# EAGLE design power_board (EAGLE 9.6.2)
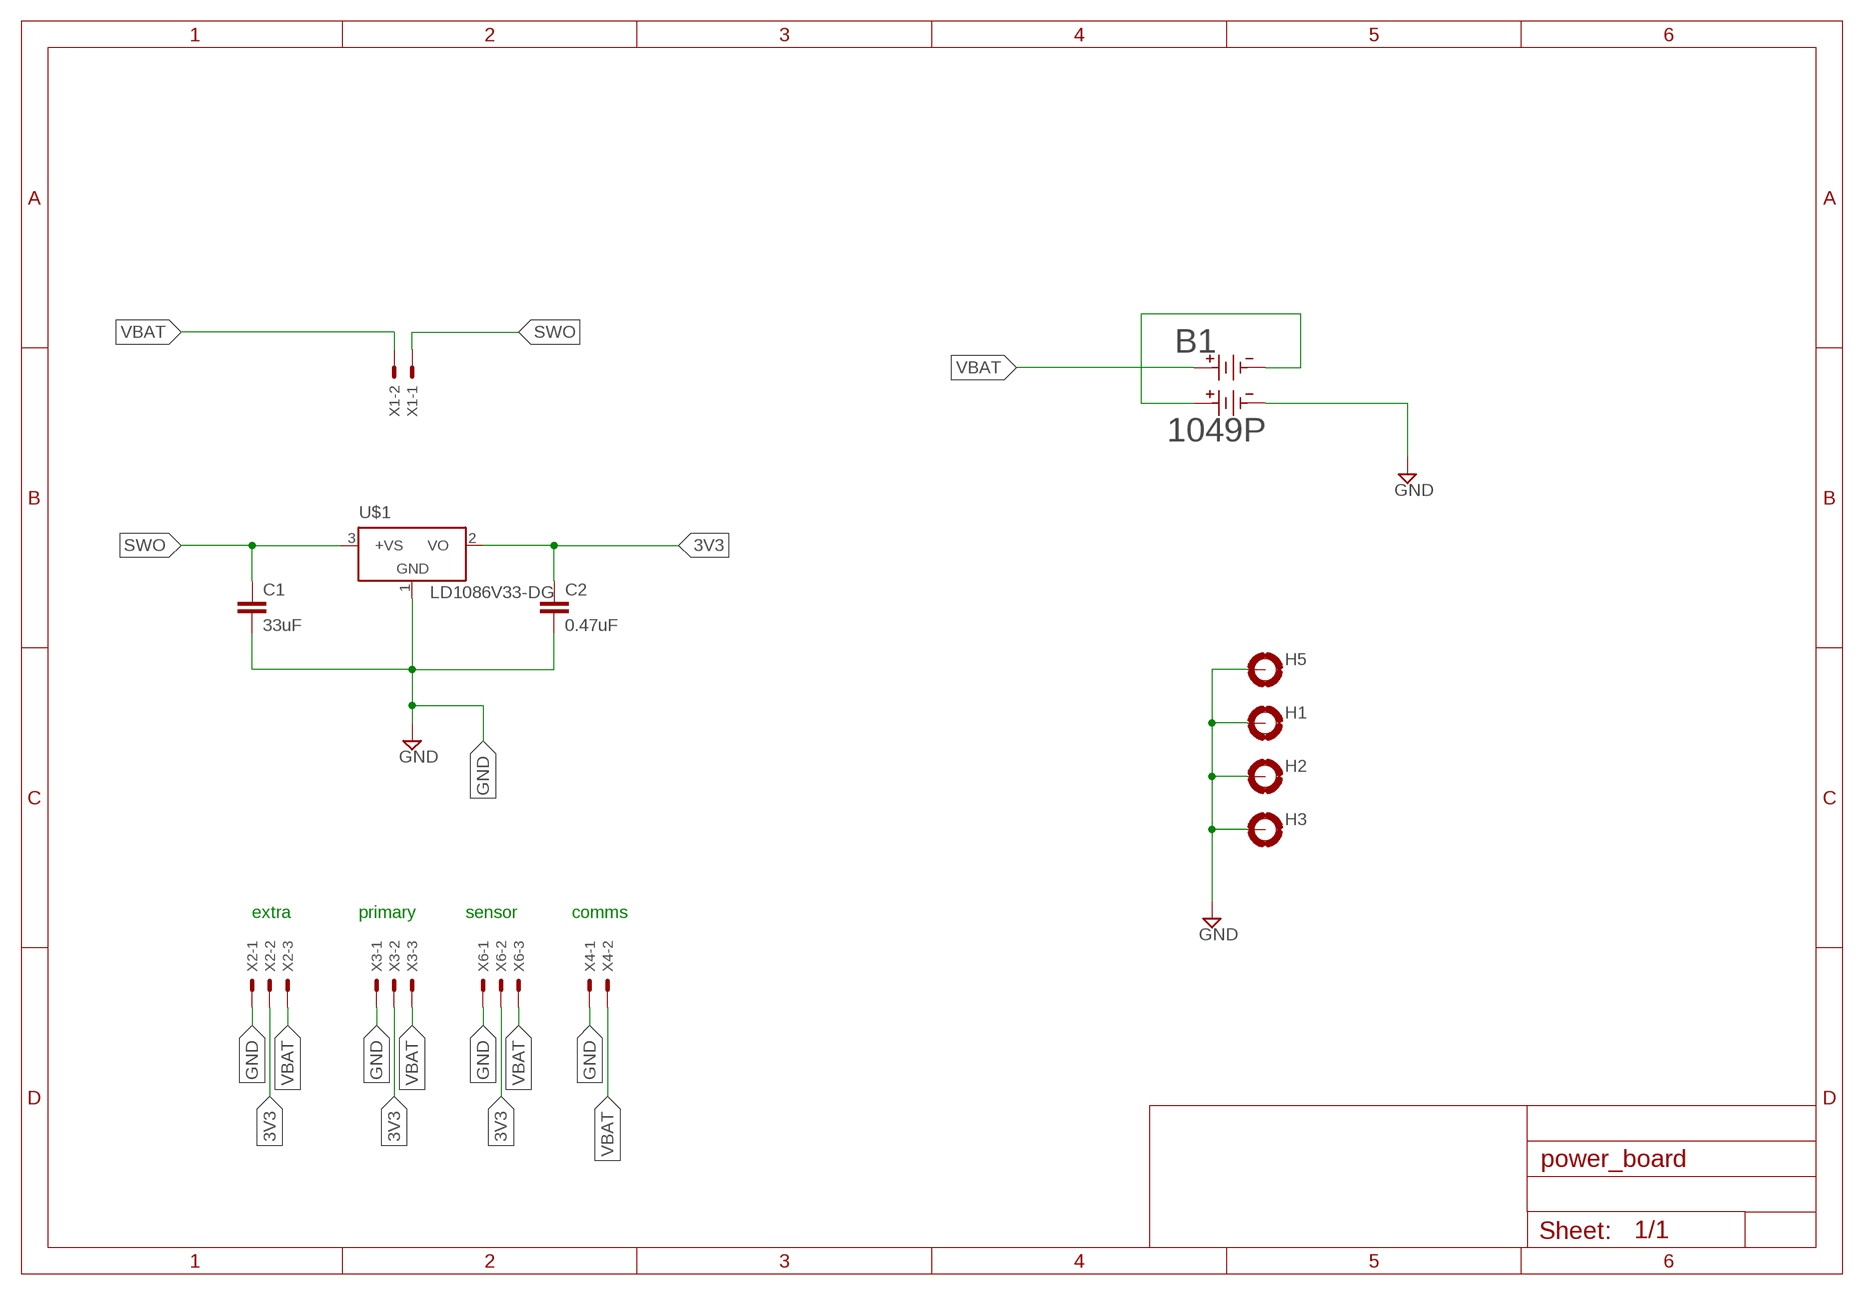
[diagram p0: schematic, sheet 1]

## Parts
B1  1049P  [1049P_KEY]
C1  33uF  C2,5-3  [C2.5-3]
C2  0.47uF  C2,5-3  [C2.5-3]
H1  MOUNT-PAD-ROUND3.0  [3,0-PAD]
H2  MOUNT-PAD-ROUND3.0  [3,0-PAD]
H3  MOUNT-PAD-ROUND3.0  [3,0-PAD]
H5  MOUNT-PAD-ROUND3.0  [3,0-PAD]
U$1  LD1086V33-DG  [TO220H]
X1  JST-XH-02-PIN  [JST-XH_S2B]
X2  JST-XH-03-PIN  [JST-XH_S3B]
X3  JST-XH-03-PIN  [JST-XH_S3B]
X4  JST-XH-02-PIN  [JST-XH_S2B]
X6  JST-XH-03-PIN  [JST-XH_S3B]

## Nets
3V3: C2.1 U$1.2(VO) X2.PIN2 X3.PIN2 X6.PIN2
GND: B1.3 C1.2 C2.2 H1.B3,0(MOUNT) H2.B3,0(MOUNT) H3.B3,0(MOUNT) H5.B3,0(MOUNT) U$1.1(GND) X2.PIN1 X3.PIN1 X4.PIN1 X6.PIN1
N$1: B1.2 B1.4
SWO: C1.1 U$1.3(+VS) X1.PIN1
VBAT: B1.1 X1.PIN2 X2.PIN3 X3.PIN3 X4.PIN2 X6.PIN3

## Notes on the sheet
- extra | primary | sensor | comms

## Library data of the parts
B1 = 1047P:1049P; COPYRIGHT: Copyright (C) 2024 Ultra Librarian. All rights reserved.; MANUFACTURER_PART_NUMBER: 1049P; MFR_NAME: Keystone Electronics
C1 C2 = capacitor-wima:C: CAPACITOR naming: grid - package width
H1-H3 H5 = holes:MOUNT-PAD-ROUND: MOUNTING PAD, round
U$1 = linear:LD1086V33-DG
X1 X4 = JST-XH Connectors:JST-XH-02-PIN: JST XH Connector 2 Pin Wire to board connector. Pitch: 2,54 mm, (0.100") Number of pins: 2 Created by Rembrandt Electronics www.rembrandtelectronics.com
X2 X3 X6 = JST-XH Connectors:JST-XH-03-PIN: JST XH Connector 2 Pin Wire to board connector. Pitch: 2,54 mm, (0.100") Number of pins: 3 Created by Rembrandt Electronics www.rembrandtelectronics.com

## Board
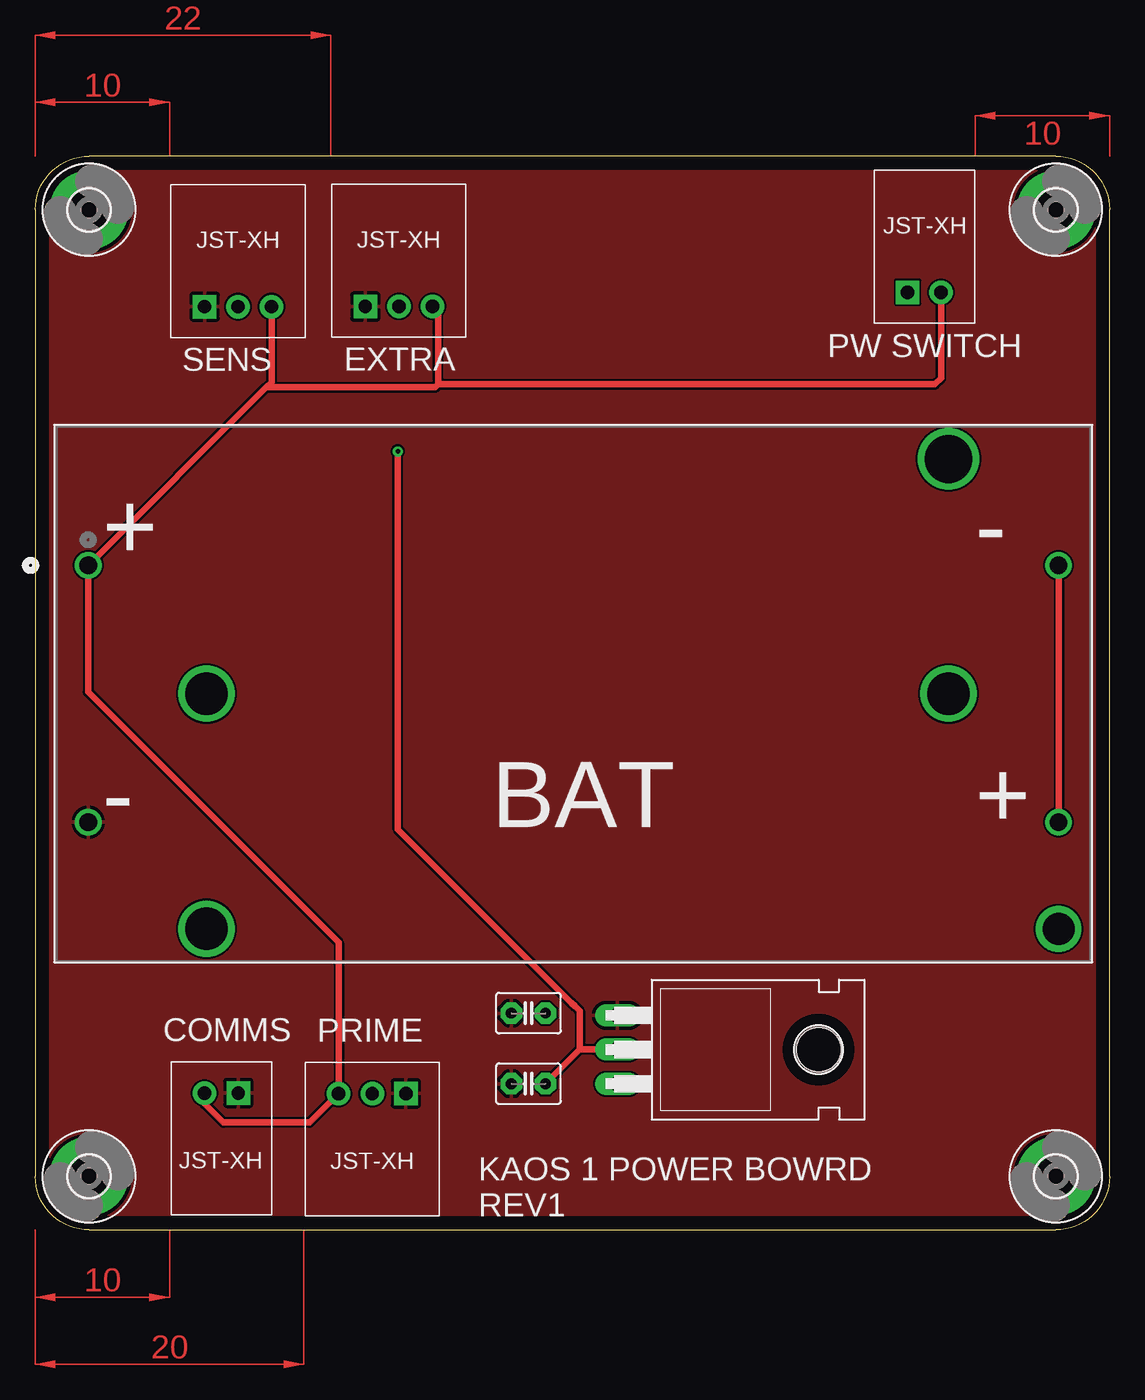
[diagram p1: board, top side]
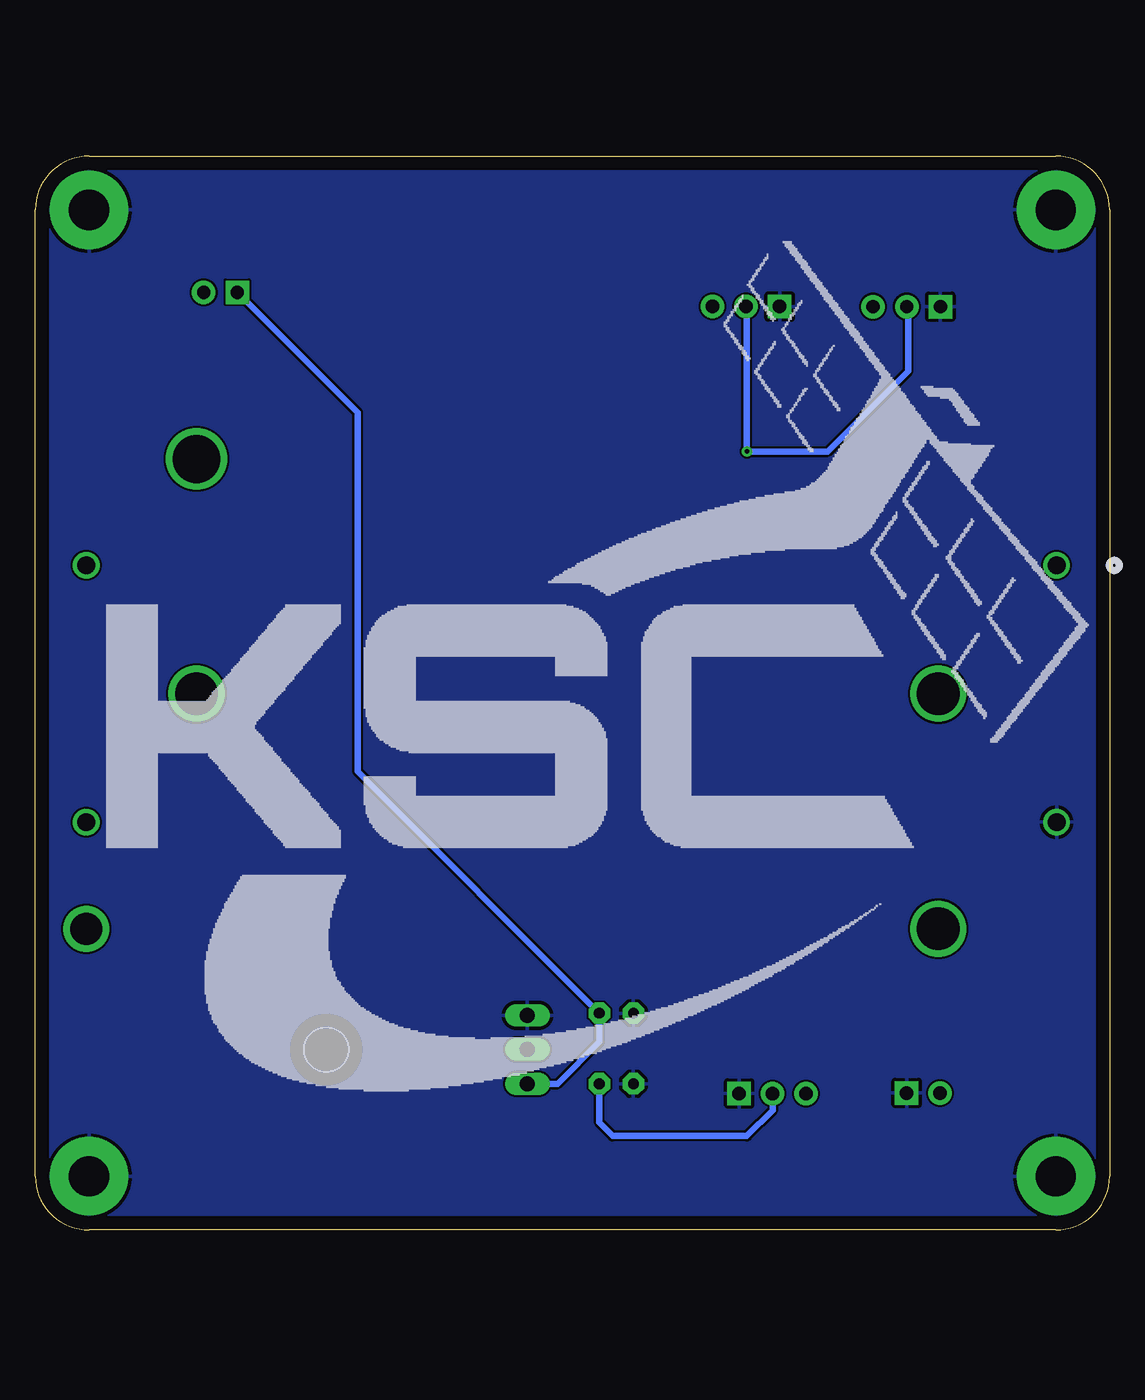
[diagram p2: board, bottom side, seen from below]

Size 80 x 80 mm. Coordinates in mm from the lower left corner, seen from the top.
Outline: 4,0 76,0 arc90 80,4 80,76 arc90 76,80 4,80 arc90 0,76 0,4 arc90 4,0
Copper layers (1*16): Top 0.035mm / dielectric 1.5mm / Bottom 0.035mm
Design rules "default": minimum track width 6mil, minimum drill 0.35mm, track to track 6mil, track to pad 6mil, pad to pad 6mil, via to via 6mil, smd to smd 6mil, copper to edge 40mil, drill to drill 6mil, minimum pad ring 10mil, minimum via ring 8mil, stop-mask expansion 4mil, vias tented up to drill 0mil, thermal gap 10mil

### Footprints (pad centres in the part's own frame; a part is rotated, then mirrored left to right if it is on the bottom)
1049P_KEY = drill 1.321 pad 1.829: 1 0,0; 2 72.263,0; 3 0,-19.126; 4 72.263,-19.126 | drill 3.556 pad 3.556: 5 64.059,7.925 | drill 3.175 pad 3.175: 6 8.814,-9.55; 7 64.059,-9.55; 8 8.814,-27.076 | drill 2.388 pad 2.388: 9 72.263,-27.076
C2.5-3 = drill 0.813 pad 1.6 octagon: 1 -1.27,0; 2 1.27,0
3,0-PAD = drill 3 pad 5.842: B3,0 0,0
TO220H = drill 1.118 long: 1 -2.54,-10.16; 2 0,-10.16; 3 2.54,-10.16 | hole 3.302: 0,4.826
JST-XH_S2B = drill 1 pad 1.75 square: PIN1 0,0 | drill 1 pad 1.75: PIN2 2.5,0
JST-XH_S3B = drill 1 pad 1.75 square: PIN1 0,0 | drill 1 pad 1.75: PIN2 2.5,0; PIN3 5,0

### Placement (x,y rotation side)
B1  3.94,49.51 0 top
C1  36.73,16.15 180 top
C2  36.72,10.89 180 top
H1  76,76 0 top
H2  4,4 0 top
H3  76,4 0 top
H5  4,76 0 top
U$1  53.51,13.44 270 top
X1  64.96,69.85 0 top
X2  24.57,68.8 0 top
X3  27.59,10.17 180 top
X4  15.11,10.21 180 top
X6  12.6,68.79 0 top

### Tracks (layer width: path | path; a pad name or v marks a point on that pad's centre or on a via)
3V3  (via drill 0.35)
  Top 0.5: 40.53,13.44 U$1.2 41.56,13.44 | 40.53,13.44 C2.1 | v27,58 27,29.85 39.92,16.92 40.2,16.65 40.53,16.31 40.53,13.44
  Bottom 0.5: X2.PIN2 27,68.73 v27,58 21,58 15,64 15,68.68 X6.PIN2 | X3.PIN2 25.09,8.91 27,7 37,7 38,8 C2.1
GND
  pour Top: 0,0 0,80 80,80 80,0
  pour Bottom: 0,0 0,80 80,80 80,0
N$1
  Top 0.5: B1.2 B1.4
SWO
  Bottom 0.5: U$1.3 41.1,10.9 37.99,14.01 C1.1 56,34.16 56,60.89 X1.PIN1
VBAT
  Top 0.5: 17.21,62.78 B1.1 3.94,40.06 22.59,21.41 X3.PIN3 20.42,8 14,8 12.61,9.39 X4.PIN2 | 17.21,62.78 17.6,63.17 X6.PIN3 | 17.21,62.78 29.79,62.78 30,63 | 30,63 30,68.37 X2.PIN3 | 30,63 67,63 67.46,63.46 X1.PIN2
(copper drawn outside any net)
  shapes: Top area x5

### Text on the board
tPlace: PW SWITCH | SENS | EXTRA | COMMS | PRIME | KAOS 1 POWER BOWRD / REV1
tNames: + | - | - | BAT | +